# EAGLE design HV (EAGLE 5.11)
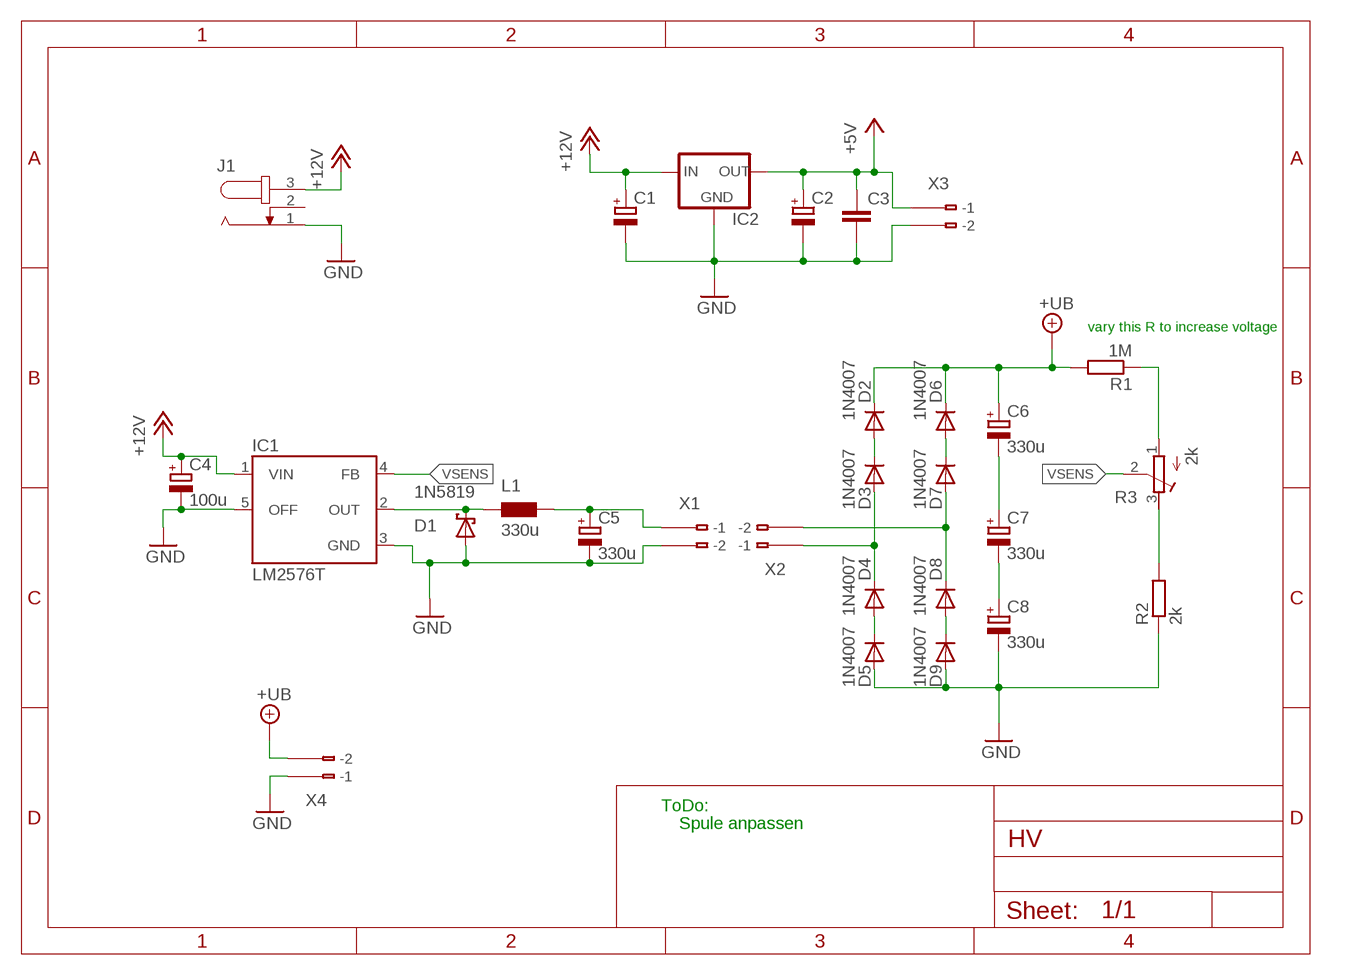
[diagram p0: schematic, sheet 1]

## Parts
C1  CPOL-EUE2.5-6  [E2,5-6]
C2  CPOL-EUE2.5-6  [E2,5-6]
C3  C-EU025-025X050  [C025-025X050]
C4  100u  CPOL-EUE2.5-6  [E2,5-6]
C5  330u  CPOL-EUE2.5-6  [E2,5-6]
C6  330u  CPOL-EUE7.5-18  [E7,5-18]
C7  330u  CPOL-EUE7.5-18  [E7,5-18]
C8  330u  CPOL-EUE7.5-18  [E7,5-18]
D1  1N5819  P4KEXX  [DO41-10]
D2  1N4007  1N4933  [DO41-10]
D3  1N4007  1N4933  [DO41-10]
D4  1N4007  1N4933  [DO41-10]
D5  1N4007  1N4933  [DO41-10]
D6  1N4007  1N4933  [DO41-10]
D7  1N4007  1N4933  [DO41-10]
D8  1N4007  1N4933  [DO41-10]
D9  1N4007  1N4933  [DO41-10]
IC1  LM2576T  [TO220-5]
IC2  78XXL  [78XXL]
J1  JACK-PLUG1  [SPC4078]
L1  330u  PIS4728  [PIS4728]
R1  1M  R-EU_0207/10  [0207/10]
R2  2k  R-EU_0207/10  [0207/10]
R3  2k  R-TRIMM64Y  [RTRIM64Y]
X1  233-202  [233-202]
X2  233-202  [233-202]
X3  233-202  [233-202]
X4  233-202  [233-202]

## Nets
+5V: C2.+ C3.1 IC2.OUT X3.B1(B-1)
+12V: C1.+ C4.+ IC1.1(VIN) IC2.IN J1.3
+UB: C6.+ D2.C D6.C R1.2 X4.B2(B-2)
GND: C1.- C2.- C3.2 C4.- C5.- C8.- D1.A D5.A D9.A IC1.3(GND) IC1.5(OFF) IC2.GND J1.1 R2.1 X1.B2(B-2) X3.B2(B-2) X4.B1(B-1)
N$1: D1.C IC1.2(OUT) L1.P$1
N$2: C5.+ L1.P$2 X1.B1(B-1)
N$3: D3.A D4.C X2.B1(B-1)
N$4: D7.A D8.C X2.B2(B-2)
N$5: D4.A D5.C
N$6: D8.A D9.C
N$7: R1.1 R3.1(E)
N$8: R2.2 R3.3(A)
N$9: C6.- C7.+
N$10: D2.A D3.C
N$11: D6.A D7.C
N$12: C7.- C8.+
VSENS: IC1.4(FB) R3.2(S)
Unconnected: J1.2 X1.A1(-1) X1.A2(-2) X2.A1(-1) X2.A2(-2) X3.A1(-1) X3.A2(-2) X4.A1(-1) X4.A2(-2)

## Notes on the sheet
- vary this R to increase voltage
- ToDo:
- Spule anpassen

## Library data of the parts
C1 C2 C4-C8 = rcl:CPOL-EU: POLARIZED CAPACITOR, European symbol
C3 = rcl:C-EU: CAPACITOR, European symbol
D1 = diode:P4KEXX: DIODE transient-voltage suppressor
D2-D9 = diode:1N4933: DIODE fast recovery rectifier, 1A
IC1 = v-reg-3:LM2576: National Semiconductor <http://www.national.com> 3.0A "Simple Switcher"(c) 52kHz, Vout 1.23-37V (HV: 57V), Vin 40V (HV: 60V), 50µA standby current
IC2 = v-reg-3:78XXL: VOLTAGE REGULATOR
J1 = con-jack:JACK-PLUG: DC POWER JACK Power Jack, DC, Right Angle, Through Hole, Rated 5A at 16VDC, PC Terminals Distributor: Farnell (www.Farnell.de) Drawing: 84N1161.pdf / 84N1162.pdf Manufacturer: SPC Technology (www.spctechnology.com) Type: SPC4077 / SPC 4078; OC_FARNELL: unknown; OC_NEWARK: unknown
L1 = inductor-fastron:PIS4728: Fastron SMD Power Inductors Source: http://www.fastrongroup.com/series/53/findProducts
R1 R2 = rcl:R-EU_: RESISTOR, European symbol
R3 = rcl:R-TRIMM: Trimm resistor
X1-X4 = con-wago:233-202: WAGO Cage Clamp; MPN: 233-202; OC_FARNELL: 1283532; OC_NEWARK: 28K9059

## Board
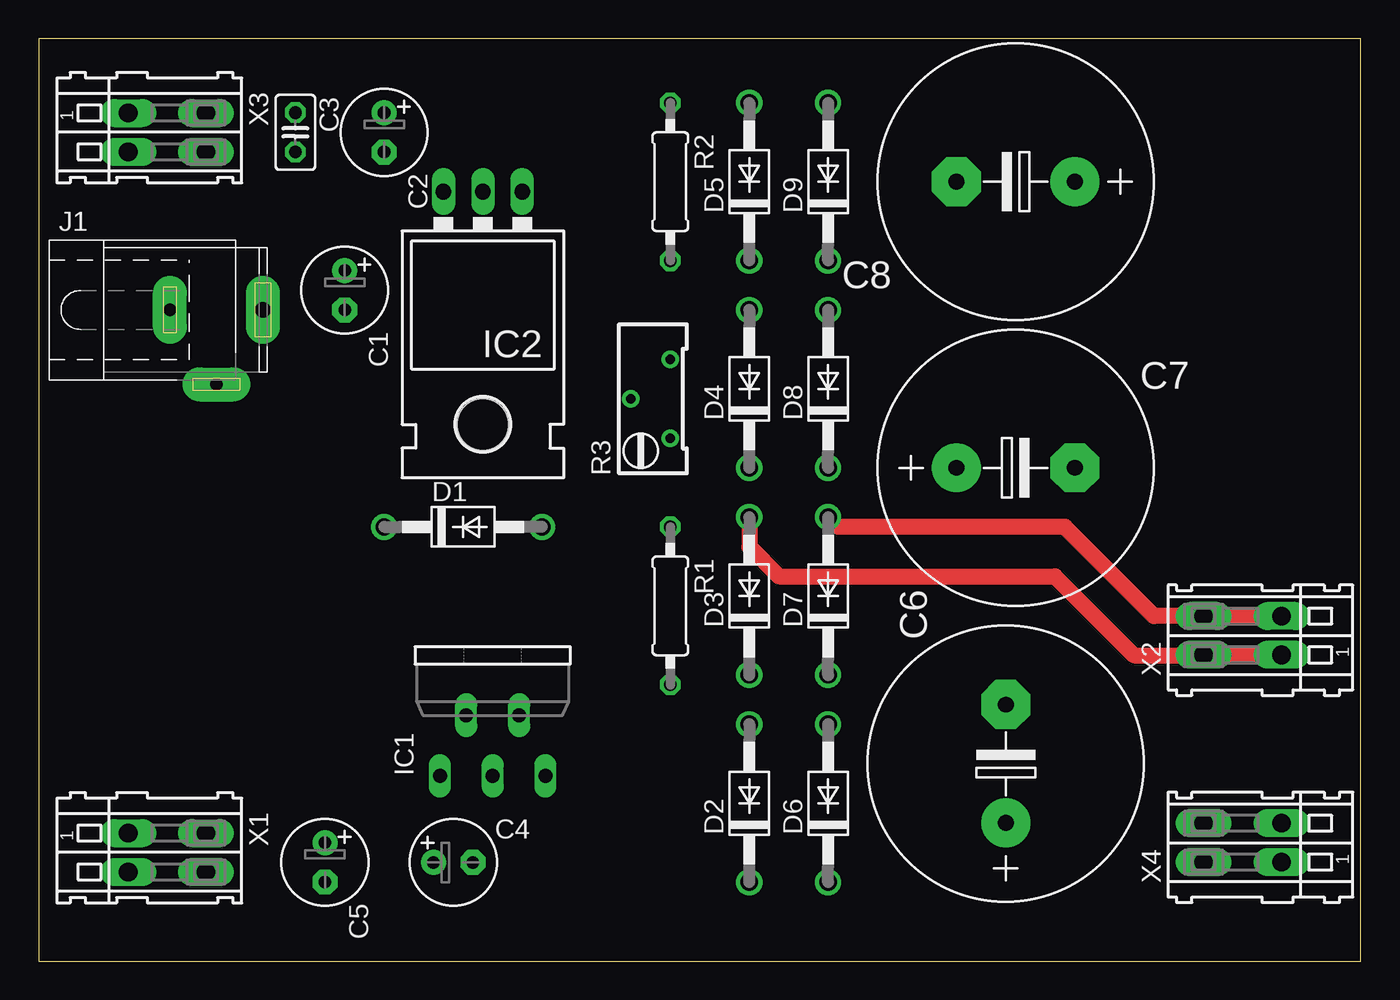
[diagram p1: board, top side]
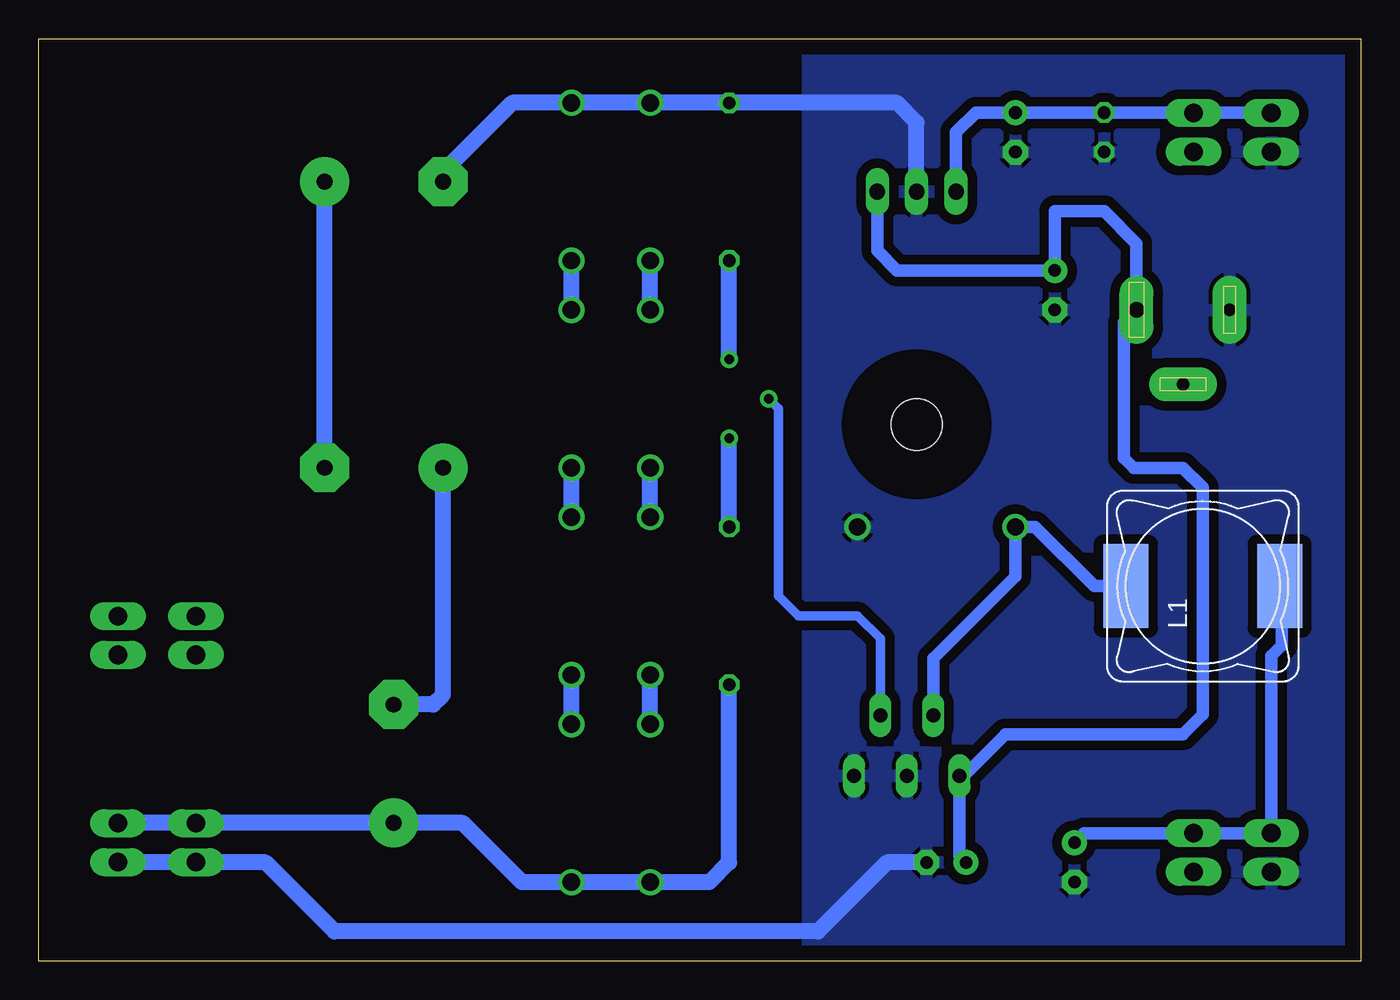
[diagram p2: board, bottom side, seen from below]

Size 85.07 x 59.36 mm. Coordinates in mm from the lower left corner, seen from the top.
Outline: 0,0 85.07,0 85.07,59.36 0,59.36 0,0
Copper layers (1*16): Top 0.035mm / dielectric 1.5mm / Bottom 0.035mm
Design rules "default": minimum track width 10mil, minimum drill 24mil, track to track 8mil, track to pad 8mil, pad to pad 8mil, via to via 8mil, smd to smd 8mil, copper to edge 40mil, drill to drill 8mil, minimum pad ring 10mil, minimum via ring 8mil, stop-mask expansion 4mil, vias tented up to drill 0mil, thermal gap 10mil

### Footprints (pad centres in the part's own frame; a part is rotated, then mirrored left to right if it is on the bottom)
E2,5-6 = drill 0.813 pad 1.6 round: + -1.27,0 | drill 0.813 pad 1.6 octagon: - 1.27,0
C025-025X050 = drill 0.813 octagon: 1 -1.27,0; 2 1.27,0
E7,5-18 = drill 1.016 pad 3.15 round: + -3.81,0 | drill 1.016 pad 3.15 octagon: - 3.81,0
DO41-10 = drill 1.118 round: A 5.08,0; C -5.08,0
TO220-5 = drill 0.9 long: 1 -3.4,-8.4; 2 -1.7,-4.5; 3 0,-8.4; 4 1.7,-4.5; 5 3.4,-8.4
78XXL = drill 1.016 long: GND 0,-3.81; IN -2.54,-3.81; OUT 2.54,-3.81 | hole 3.302: 0,11.176
SPC4078 = drill 0.8 pad 2.184 long: 1 -3,0; 2 0,-4.8 | drill 1 pad 2.184 long: 3 3,0
PIS4728 = smd 5.4 x 2.9: P$1 0,4.95; P$2 0,-4.95
0207/10 = drill 0.813 octagon: 1 -5.08,0; 2 5.08,0
RTRIM64Y = drill 0.61 round: 1 0,-2.54; 2 -2.54,0; 3 0,2.54
233-202 = drill 1.2 long: A1 -1.25,2.5; A2 1.25,2.5; B1 -1.25,-2.5; B2 1.25,-2.5

### Placement (x,y rotation side)
C1  19.68,43.18 270 top
C2  22.23,53.34 270 top
C3  16.51,53.34 270 top
C4  26.67,6.35 0 top
C5  18.41,6.35 270 top
C6  62.23,12.7 90 top
C7  62.87,31.75 0 top
C8  62.87,50.16 180 top
D1  27.3,27.94 0 top
D2  45.72,10.16 90 top
D3  45.72,23.5 90 top
D4  45.72,36.83 90 top
D5  45.72,50.16 90 top
D6  50.8,10.16 90 top
D7  50.8,23.5 90 top
D8  50.8,36.83 90 top
D9  50.8,50.16 90 top
IC1  29.21,20.32 0 top
IC2  28.57,45.72 180 top
J1  11.43,41.91 0 top
L1  10.16,24.13 90 bottom
R1  40.64,22.86 270 top
R2  40.64,50.16 270 top
R3  40.64,36.2 0 top
X1  8.26,6.99 270 top
X2  77.47,20.95 90 top
X3  8.26,53.34 270 top
X4  77.47,7.62 90 top

### Tracks (layer width: path | path; a pad name or v marks a point on that pad's centre or on a via)
+5V
  Bottom 0.813: X3.B1 5.78,54.61 C3.1 C2.+ 24.77,54.61 26.04,53.34 IC2.OUT
+12V
  Bottom 0.813: J1.3 14.43,46.18 16.51,48.26 19.68,48.26 C1.+ 29.84,44.45 31.11,45.72 IC2.IN | C4.+ 25.81,6.76 IC1.1 25.55,11.92 22.86,14.61 11.43,14.61 10.16,15.88 10.16,30.48 11.43,31.75 14.61,31.75 15.24,32.38 15.24,41.1 J1.3 | J1.3 14.43,40.18
+UB
  Bottom 1.016: R1.2 40.64,6.35 41.91,5.08 D2.C D6.C 53.98,5.08 57.78,8.89 C6.+ 79.95,8.89 X4.B2
GND
  Bottom 1.016: C4.- 30.48,6.35 34.92,1.91 66.04,1.91 70.48,6.35 79.95,6.35 X4.B1 | IC2.GND 28.57,53.98 29.84,55.24 R2.1 D5.A D9.A 54.61,55.24 59.05,50.8 C8.-
  pour Bottom (isolate 0.61): 0.64,58.42 35.56,58.42 35.56,0.64 0.64,0.64
N$1
  Bottom 0.813: L1.P$1 17.14,24.13 20.95,27.94 D1.C 22.23,24.77 27.51,19.48 IC1.2
N$2
  Bottom 0.813: L1.P$2 5.08,24 5.08,20.32 5.75,19.64 X1.B1 17.8,8.23 C5.+
N$3
  Top 1.016: D3.A 45.72,26.67 47.62,24.77 65.41,24.77 70.48,19.68 79.95,19.68 X2.B1
  Bottom 1.016: D3.A D4.C
N$4
  Top 1.016: X2.B2 71.78,22.2 66.04,27.94 51.44,27.94 D7.A
  Bottom 1.016: D7.A D8.C
N$5
  Bottom 1.016: D4.A D5.C
N$6
  Bottom 1.016: D8.A D9.C
N$7
  Bottom 1.016: R1.1 R3.1
N$8
  Bottom 1.016: R3.3 R2.2
N$9
  Bottom 1.016: C7.+ 59.05,17.14 59.69,16.51 C6.-
N$10
  Bottom 1.016: D2.A D3.C
N$11
  Bottom 1.016: D6.A D7.C
N$12
  Bottom 1.016: C7.- C8.+
VSENS
  Bottom 0.61: IC1.4 30.91,20.75 32.38,22.23 36.2,22.23 37.47,23.5 37.47,35.56 R3.2

### Text on the board
Bottom: HV-supply | Severin Haas 2013